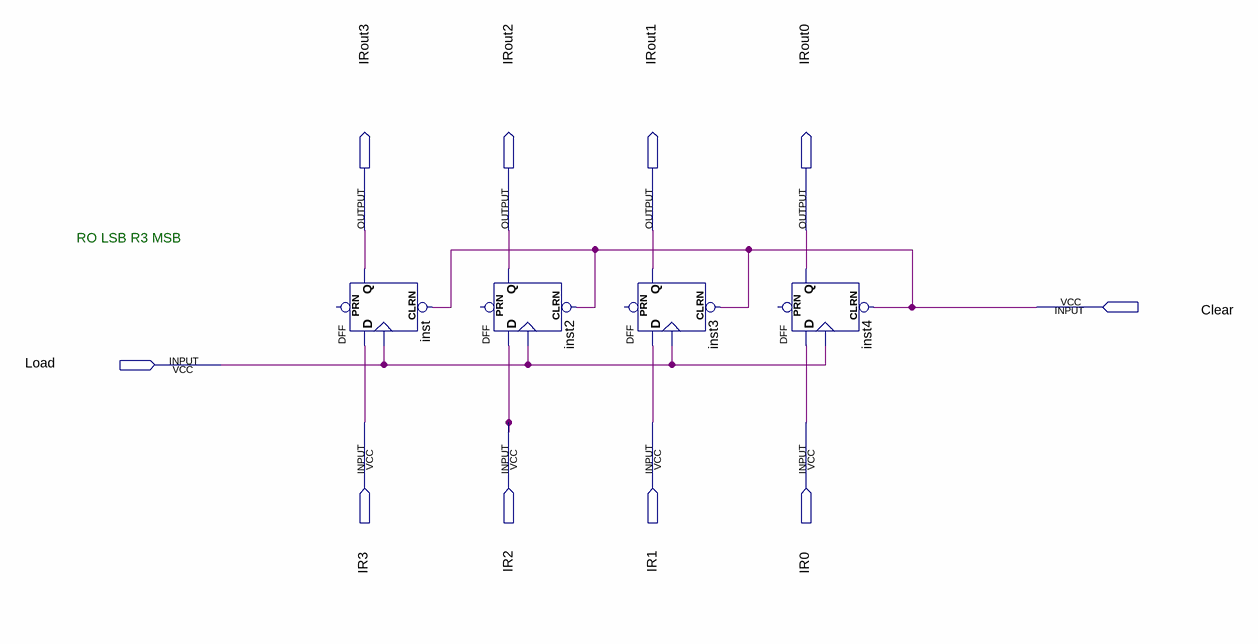
[diagram p0: schematic sheet]
// Quartus schematic InstructionRegister.bdf as structural Verilog: 4 symbols, 10 pins
module InstructionRegister (
  input  Clear,
  input  Load,
  input  IR3,
  input  IR2,
  input  IR1,
  input  IR0,
  output IRout3,
  output IRout2,
  output IRout1,
  output IRout0
);

  DFF inst (.CLRN(Clear), .CLK(Load), .D(IR3), .Q(IRout3));  // open: PRN
  DFF inst2 (.CLRN(Clear), .CLK(Load), .D(IR2), .Q(IRout2));  // open: PRN
  DFF inst3 (.CLRN(Clear), .CLK(Load), .D(IR1), .Q(IRout1));  // open: PRN
  DFF inst4 (.CLRN(Clear), .CLK(Load), .D(IR0), .Q(IRout0));  // open: PRN

  // Notes on the sheet:
  //   RO LSB R3 MSB
endmodule
